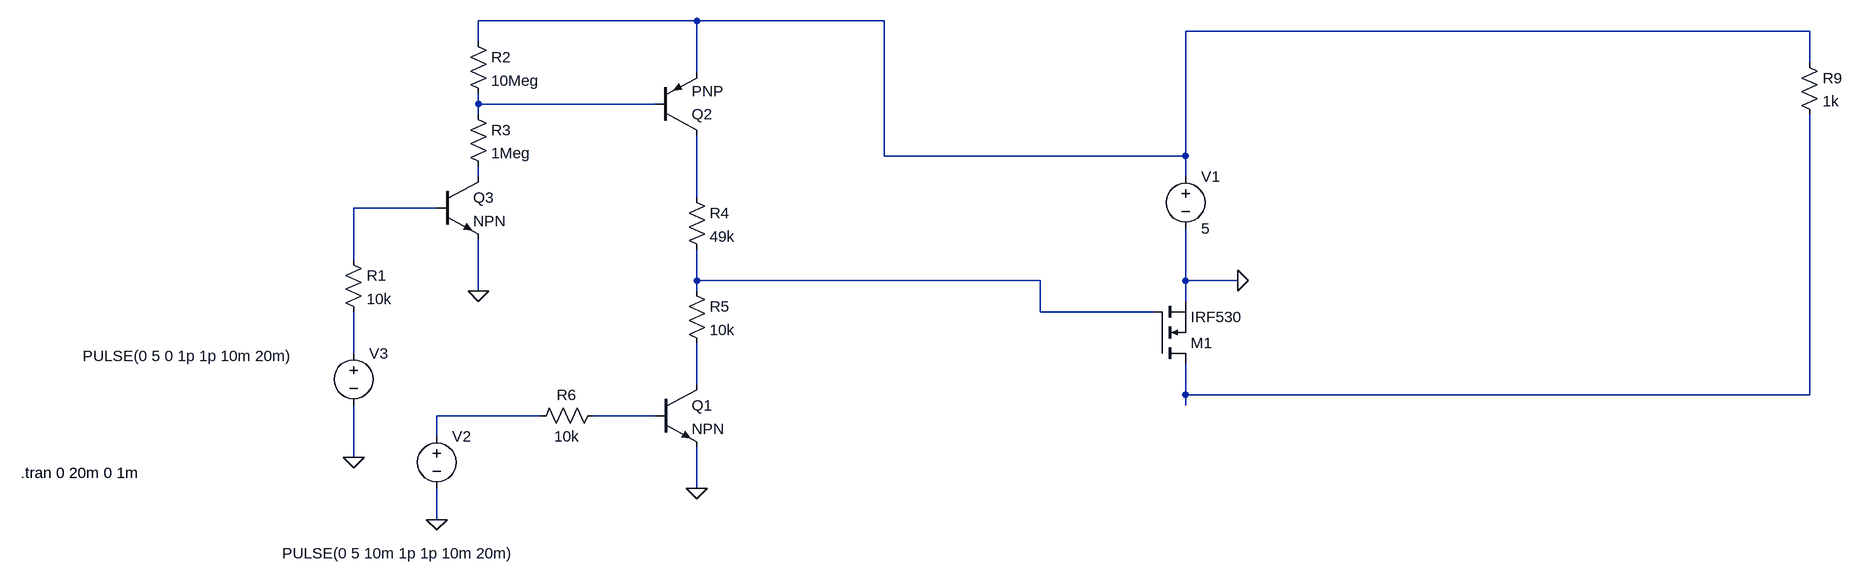
[diagram p0: schematic version1.2_nmos.asc]
version1.2_nmos.asc, the LTspice schematic file:
Version 4.1
SHEET 1 2348 1360
WIRE -592 -208 -928 -208
WIRE -304 -208 -592 -208
WIRE 1120 -192 160 -192
WIRE -928 -176 -928 -208
WIRE 1120 -144 1120 -192
WIRE -592 -128 -592 -208
WIRE -928 -80 -928 -96
WIRE -656 -80 -928 -80
WIRE -928 -64 -928 -80
WIRE -304 0 -304 -208
WIRE 160 0 160 -192
WIRE 160 0 -304 0
WIRE -928 32 -928 16
WIRE 160 32 160 0
WIRE -592 64 -592 -32
WIRE -992 80 -1120 80
WIRE -1120 160 -1120 80
WIRE -592 192 -592 144
WIRE -64 192 -592 192
WIRE 160 192 160 112
WIRE 240 192 160 192
WIRE -928 208 -928 128
WIRE -592 208 -592 192
WIRE 160 224 160 192
WIRE -64 240 -64 192
WIRE 112 240 -64 240
WIRE -1120 304 -1120 240
WIRE -592 352 -592 288
WIRE 160 368 160 320
WIRE 1120 368 1120 -64
WIRE 1120 368 160 368
WIRE 160 384 160 368
WIRE -832 400 -992 400
WIRE -656 400 -752 400
WIRE -992 432 -992 400
WIRE -1120 464 -1120 384
WIRE -592 512 -592 448
WIRE -992 560 -992 512
FLAG -992 560 0
FLAG -1120 464 0
FLAG -928 208 0
FLAG -592 512 0
FLAG 240 192 0
SYMBOL npn -656 352 R0
SYMATTR InstName Q1
SYMBOL res -608 192 R0
SYMATTR InstName R5
SYMATTR Value 10k
SYMBOL voltage -992 416 R0
WINDOW 3 -238 196 Left 2
WINDOW 123 0 0 Left 0
WINDOW 39 0 0 Left 0
SYMATTR Value PULSE(0 5 10m 1p 1p 10m 20m)
SYMATTR InstName V2
SYMBOL res -608 48 R0
SYMATTR InstName R4
SYMATTR Value 49k
SYMBOL npn -992 32 R0
SYMATTR InstName Q3
SYMBOL res -944 -80 R0
SYMATTR InstName R3
SYMATTR Value 1Meg
SYMBOL res -944 -192 R0
SYMATTR InstName R2
SYMATTR Value 10Meg
SYMBOL res -1136 144 R0
SYMATTR InstName R1
SYMATTR Value 10k
SYMBOL voltage -1120 288 R0
WINDOW 3 -417 20 Left 2
WINDOW 123 0 0 Left 0
WINDOW 39 0 0 Left 0
SYMATTR Value PULSE(0 5 0 1p 1p 10m 20m)
SYMATTR InstName V3
SYMBOL res -736 384 R90
WINDOW 0 0 56 VBottom 2
WINDOW 3 32 56 VTop 2
SYMATTR InstName R6
SYMATTR Value 10k
SYMBOL voltage 160 16 R0
WINDOW 123 0 0 Left 0
WINDOW 39 0 0 Left 0
SYMATTR InstName V1
SYMATTR Value 5
SYMBOL pnp -656 -32 M180
SYMATTR InstName Q2
SYMBOL res 1104 -160 R0
SYMATTR InstName R9
SYMATTR Value 1k
SYMBOL nmos 112 320 M180
SYMATTR InstName M1
SYMATTR Value IRF530
TEXT -1632 488 Left 2 !.tran 0 20m 0 1m

The netlist it stands for:
* version1.2_nmos.asc
Q1 N008 N011 0 0 NPN
R5 N006 N008 10k
V2 N010 0 PULSE(0 5 10m 1p 1p 10m 20m)
R4 N004 N006 49k
Q3 N003 N005 0 0 NPN
R3 N002 N003 1Meg
R2 N001 N002 10Meg
R1 N005 N007 10k
V3 N007 0 PULSE(0 5 0 1p 1p 10m 20m)
R6 N011 N010 10k
V1 N001 0 5
Q2 N004 N002 N001 0 PNP
R9 N001 N009 1k
M1 N009 N006 0 0 IRF530
.model NPN NPN
.model PNP PNP
.lib standard.bjt
.model NMOS NMOS
.model PMOS PMOS
.lib standard.mos
.tran 0 20m 0 1m
.backanno
.end